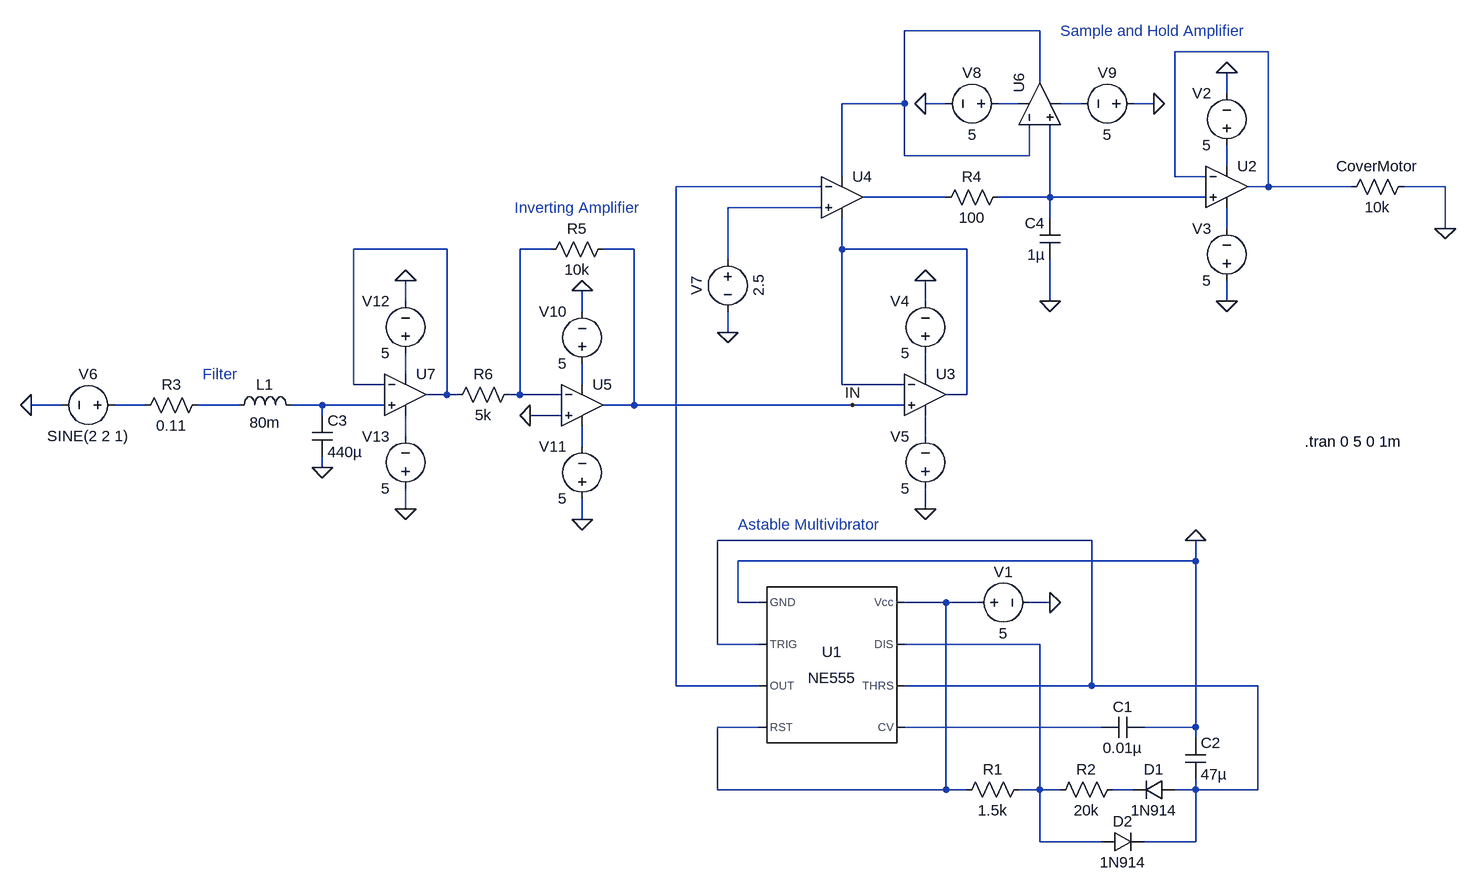
[diagram p0: schematic CoverMotorCircuit.asc]
CoverMotorCircuit.asc, the LTspice schematic file:
Version 4
SHEET 1 1636 680
WIRE 544 -816 336 -816
WIRE 896 -784 752 -784
WIRE 544 -736 544 -816
WIRE 832 -720 832 -752
WIRE 336 -704 336 -816
WIRE 336 -704 240 -704
WIRE 400 -704 368 -704
WIRE 512 -704 480 -704
WIRE 608 -704 576 -704
WIRE 720 -704 688 -704
WIRE 336 -624 336 -704
WIRE 528 -624 528 -672
WIRE 528 -624 336 -624
WIRE 832 -608 832 -640
WIRE 240 -592 240 -704
WIRE 752 -592 752 -784
WIRE 800 -592 752 -592
WIRE 208 -576 -16 -576
WIRE 896 -576 896 -784
WIRE 896 -576 864 -576
WIRE 1024 -576 896 -576
WIRE 1168 -576 1104 -576
WIRE 400 -560 272 -560
WIRE 560 -560 560 -672
WIRE 560 -560 480 -560
WIRE 800 -560 560 -560
WIRE 208 -544 64 -544
WIRE 560 -528 560 -560
WIRE 832 -512 832 -544
WIRE 1168 -512 1168 -576
WIRE -368 -480 -512 -480
WIRE -208 -480 -256 -480
WIRE -80 -480 -128 -480
WIRE 240 -480 240 -528
WIRE 432 -480 240 -480
WIRE 64 -464 64 -544
WIRE -432 -400 -432 -432
WIRE 368 -400 368 -432
WIRE 560 -400 560 -464
WIRE 832 -400 832 -432
WIRE -160 -384 -160 -416
WIRE 64 -352 64 -384
WIRE -432 -288 -432 -320
WIRE 368 -288 368 -320
WIRE -512 -272 -512 -480
WIRE -464 -272 -512 -272
WIRE -160 -272 -160 -304
WIRE 240 -272 240 -480
WIRE 336 -272 240 -272
WIRE -368 -256 -368 -480
WIRE -368 -256 -400 -256
WIRE -352 -256 -368 -256
WIRE -256 -256 -256 -480
WIRE -256 -256 -272 -256
WIRE -192 -256 -256 -256
WIRE 432 -256 432 -480
WIRE 432 -256 400 -256
WIRE -960 -240 -1008 -240
WIRE -832 -240 -880 -240
WIRE -688 -240 -752 -240
WIRE -560 -240 -608 -240
WIRE -464 -240 -560 -240
WIRE -80 -240 -80 -480
WIRE -80 -240 -128 -240
WIRE 256 -240 -80 -240
WIRE 336 -240 256 -240
WIRE -560 -224 -560 -240
WIRE -192 -224 -240 -224
WIRE -432 -192 -432 -224
WIRE 368 -192 368 -224
WIRE -160 -176 -160 -208
WIRE -560 -144 -560 -160
WIRE -432 -80 -432 -112
WIRE 368 -80 368 -112
WIRE -160 -64 -160 -96
WIRE 624 -32 48 -32
WIRE 784 0 784 -32
WIRE 784 0 80 0
WIRE 80 64 80 0
WIRE 112 64 80 64
WIRE 400 64 336 64
WIRE 448 64 400 64
WIRE 560 64 528 64
WIRE 48 128 48 -32
WIRE 112 128 48 128
WIRE 544 128 336 128
WIRE -16 192 -16 -576
WIRE 112 192 -16 192
WIRE 624 192 624 -32
WIRE 624 192 336 192
WIRE 880 192 624 192
WIRE 112 256 48 256
WIRE 640 256 336 256
WIRE 784 256 784 0
WIRE 784 256 704 256
WIRE 784 272 784 256
WIRE 48 352 48 256
WIRE 400 352 400 64
WIRE 400 352 48 352
WIRE 432 352 400 352
WIRE 544 352 544 128
WIRE 544 352 512 352
WIRE 576 352 544 352
WIRE 688 352 656 352
WIRE 784 352 784 336
WIRE 784 352 752 352
WIRE 880 352 880 192
WIRE 880 352 784 352
WIRE 544 432 544 352
WIRE 640 432 544 432
WIRE 784 432 784 352
WIRE 784 432 704 432
FLAG 560 64 0
FLAG 784 -32 0
FLAG 368 -80 0
FLAG 368 -432 0
FLAG -1008 -240 0
FLAG 256 -240 IN
FLAG 64 -352 0
FLAG 720 -704 0
FLAG 368 -704 0
FLAG 560 -400 0
FLAG 1168 -512 0
FLAG 832 -400 0
FLAG 832 -752 0
FLAG -160 -64 0
FLAG -160 -416 0
FLAG -240 -224 0
FLAG -432 -80 0
FLAG -432 -432 0
FLAG -560 -144 0
SYMBOL Misc\\NE555 224 160 R0
SYMATTR InstName U1
SYMBOL voltage 432 64 R270
WINDOW 0 32 56 VTop 2
WINDOW 3 -32 56 VBottom 2
SYMATTR InstName V1
SYMATTR Value 5
SYMBOL res 528 336 R90
WINDOW 0 0 56 VBottom 2
WINDOW 3 32 56 VTop 2
SYMATTR InstName R1
SYMATTR Value 1.5k
SYMBOL res 672 336 R90
WINDOW 0 0 56 VBottom 2
WINDOW 3 32 56 VTop 2
SYMATTR InstName R2
SYMATTR Value 20k
SYMBOL diode 752 336 R90
WINDOW 0 0 32 VBottom 2
WINDOW 3 32 32 VTop 2
SYMATTR InstName D1
SYMATTR Value 1N914
SYMBOL diode 640 448 R270
WINDOW 0 32 32 VTop 2
WINDOW 3 0 32 VBottom 2
SYMATTR InstName D2
SYMATTR Value 1N914
SYMBOL cap 640 272 R270
WINDOW 0 32 32 VTop 2
WINDOW 3 0 32 VBottom 2
SYMATTR InstName C1
SYMATTR Value 0.01µ
SYMBOL cap 768 272 R0
SYMATTR InstName C2
SYMATTR Value 47µ
SYMBOL OpAmps\\UniversalOpamp2 368 -256 R0
SYMATTR InstName U3
SYMBOL voltage 368 -304 R180
WINDOW 0 24 96 Left 2
WINDOW 3 24 16 Left 2
SYMATTR InstName V4
SYMATTR Value 5
SYMBOL voltage 368 -96 R180
WINDOW 0 24 96 Left 2
WINDOW 3 24 16 Left 2
SYMATTR InstName V5
SYMATTR Value 5
SYMBOL voltage -864 -240 R90
WINDOW 0 -32 56 VBottom 2
WINDOW 3 32 56 VTop 2
WINDOW 123 0 0 Left 0
WINDOW 39 0 0 Left 0
SYMATTR InstName V6
SYMATTR Value SINE(2 2 1)
SYMBOL OpAmps\\UniversalOpamp2 240 -560 R0
SYMATTR InstName U4
SYMBOL voltage 64 -480 R0
WINDOW 0 -32 56 VBottom 2
WINDOW 3 32 56 VTop 2
WINDOW 123 0 0 Left 0
WINDOW 39 0 0 Left 0
SYMATTR InstName V7
SYMATTR Value 2.5
SYMBOL OpAmps\\UniversalOpamp2 544 -704 R270
SYMATTR InstName U6
SYMBOL voltage 496 -704 R90
WINDOW 0 -32 56 VBottom 2
WINDOW 3 32 56 VTop 2
SYMATTR InstName V8
SYMATTR Value 5
SYMBOL voltage 704 -704 R90
WINDOW 0 -32 56 VBottom 2
WINDOW 3 32 56 VTop 2
SYMATTR InstName V9
SYMATTR Value 5
SYMBOL cap 576 -464 R180
WINDOW 0 24 56 Left 2
WINDOW 3 24 8 Left 2
SYMATTR InstName C4
SYMATTR Value 1µ
SYMBOL res 496 -576 R90
WINDOW 0 0 56 VBottom 2
WINDOW 3 32 56 VTop 2
SYMATTR InstName R4
SYMATTR Value 100
SYMBOL res 1120 -592 R90
WINDOW 0 0 56 VBottom 2
WINDOW 3 32 56 VTop 2
SYMATTR InstName CoverMotor
SYMATTR Value 10k
SYMBOL OpAmps\\UniversalOpamp2 832 -576 R0
SYMATTR InstName U2
SYMBOL voltage 832 -624 R180
WINDOW 0 24 96 Left 2
WINDOW 3 24 16 Left 2
SYMATTR InstName V2
SYMATTR Value 5
SYMBOL voltage 832 -416 R180
WINDOW 0 24 96 Left 2
WINDOW 3 24 16 Left 2
SYMATTR InstName V3
SYMATTR Value 5
SYMBOL res -736 -256 R90
WINDOW 0 0 56 VBottom 2
WINDOW 3 32 56 VTop 2
SYMATTR InstName R3
SYMATTR Value 0.11
SYMBOL ind -704 -224 R270
WINDOW 0 32 56 VTop 2
WINDOW 3 5 56 VBottom 2
SYMATTR InstName L1
SYMATTR Value 80m
SYMBOL cap -576 -224 R0
SYMATTR InstName C3
SYMATTR Value 440µ
SYMBOL OpAmps\\UniversalOpamp2 -160 -240 R0
SYMATTR InstName U5
SYMBOL voltage -160 -288 R180
WINDOW 0 24 96 Left 2
WINDOW 3 24 16 Left 2
SYMATTR InstName V10
SYMATTR Value 5
SYMBOL voltage -160 -80 R180
WINDOW 0 24 96 Left 2
WINDOW 3 24 16 Left 2
SYMATTR InstName V11
SYMATTR Value 5
SYMBOL res -112 -496 R90
WINDOW 0 0 56 VBottom 2
WINDOW 3 32 56 VTop 2
SYMATTR InstName R5
SYMATTR Value 10k
SYMBOL res -256 -272 R90
WINDOW 0 0 56 VBottom 2
WINDOW 3 32 56 VTop 2
SYMATTR InstName R6
SYMATTR Value 5k
SYMBOL OpAmps\\UniversalOpamp2 -432 -256 R0
SYMATTR InstName U7
SYMBOL voltage -432 -304 R180
WINDOW 0 24 96 Left 2
WINDOW 3 24 16 Left 2
SYMATTR InstName V12
SYMATTR Value 5
SYMBOL voltage -432 -96 R180
WINDOW 0 24 96 Left 2
WINDOW 3 24 16 Left 2
SYMATTR InstName V13
SYMATTR Value 5
TEXT 952 -184 Left 2 !.tran 0 5 0 1m
TEXT -744 -288 Left 2 ;Filter
TEXT -264 -544 Left 2 ;Inverting Amplifier
TEXT 80 -56 Left 2 ;Astable Multivibrator
TEXT 576 -816 Left 2 ;Sample and Hold Amplifier

The netlist it stands for:
* CoverMotorCircuit.asc
XU1 0 N023 N006 N024 N026 N023 N025 N024 NE555  ; pins GND TRIG OUT RST CV THRS DIS Vcc
V1 N024 0 5
R1 N025 N024 1.5k
R2 N027 N025 20k
D1 N023 N027 1N914
D2 N025 N023 1N914
C1 N026 0 0.01µ
C2 0 N023 47µ
XU3 IN N013 N015 N021 N013 level.2 Avol=1Meg GBW=10Meg Slew=10Meg ilimit=25m rail=0 Vos=0 phimargin=45 en=0 enk=0 in=0 ink=0 Rin=500Meg  ; pins IN+ IN- V+ V- OUT
V4 N015 0 5
V5 0 N021 5
V6 N017 0 SINE(2 2 1)
XU4 N009 N006 N001 N013 N007 level.2 Avol=1Meg GBW=10Meg Slew=10Meg ilimit=25m rail=0 Vos=0 phimargin=45 en=0 enk=0 in=0 ink=0 Rin=500Meg  ; pins IN+ IN- V+ V- OUT
V7 N009 0 2.5
XU6 N008 N001 N003 N004 N001 level.2 Avol=1Meg GBW=10Meg Slew=10Meg ilimit=25m rail=0 Vos=0 phimargin=45 en=0 enk=0 in=0 ink=0 Rin=500Meg  ; pins IN+ IN- V+ V- OUT
V8 N003 0 5
V9 0 N004 5
C4 0 N008 1µ
R4 N008 N007 100
R§CoverMotor 0 N002 10k
XU2 N008 N002 N005 N010 N002 level.2 Avol=1Meg GBW=10Meg Slew=10Meg ilimit=25m rail=0 Vos=0 phimargin=45 en=0 enk=0 in=0 ink=0 Rin=500Meg  ; pins IN+ IN- V+ V- OUT
V2 N005 0 5
V3 0 N010 5
R3 N018 N017 0.11
L1 N018 N019 80m
C3 N019 0 440µ
XU5 0 N012 N016 N022 IN level.2 Avol=1Meg GBW=10Meg Slew=10Meg ilimit=25m rail=0 Vos=0 phimargin=45 en=0 enk=0 in=0 ink=0 Rin=500Meg  ; pins IN+ IN- V+ V- OUT
V10 N016 0 5
V11 0 N022 5
R5 IN N012 10k
R6 N012 N011 5k
XU7 N019 N011 N014 N020 N011 level.2 Avol=1Meg GBW=10Meg Slew=10Meg ilimit=25m rail=0 Vos=0 phimargin=45 en=0 enk=0 in=0 ink=0 Rin=500Meg  ; pins IN+ IN- V+ V- OUT
V12 N014 0 5
V13 0 N020 5
.model D D
.lib standard.dio
.tran 0 5 0 1m
* Filter
* Inverting Amplifier
* Astable Multivibrator
* Sample and Hold Amplifier
.lib NE555.sub
.lib UniversalOpamps2.sub
.backanno
.end